# Altium project Simple Oscillator.PrjPcb
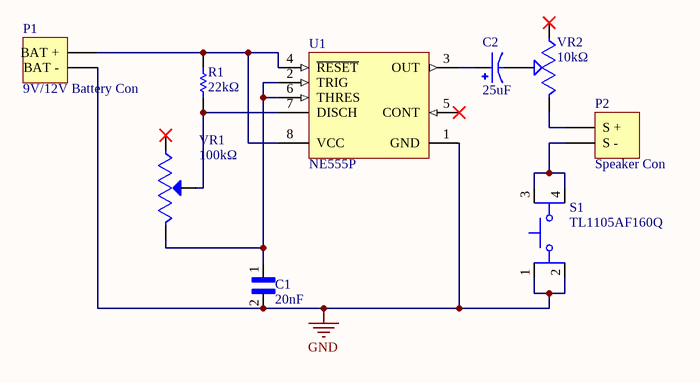
[diagram p0: Simple Oscillator.SchDoc]
1 sheet, 9 parts. Net scope: global (net labels, ports and power ports of the same name join across sheets).
Board file: Simple Oscillator.PcbDoc

## Sheet Simple Oscillator.SchDoc
size A4

### Parts
C1  20nF  [CC0603KRX7R9BB203]
C2  25uF  [EEUED2C250U]
P1  9V/12V Battery Con  [HDR1X2]
P2  Speaker Con  [HDR1X2]
R1  22kΩ  [RESC1005X40X25NL05T10]
S1  TL1105AF160Q  [TL1105AF160Q]
U1  NE555P  [P0008A]
VR1  100kΩ  [3296W-1-104]
VR2  10kΩ  [3296X-1-103]

### Nets
GND: C1.2 P1.1(BAT_-) S1.1 S1.2 U1.1(GND)
NetC1_1: C1.1 U1.2(TRIG) U1.6(THRES) VR1.3(CW)
NetC2_N: C2.N VR2.2(B)
NetC2_P: C2.P U1.3(OUT)
NetP1_2: P1.2(BAT_+) R1.2 U1.4(~{RESET}) U1.8(VCC)
NetP2_1: P2.1(S_+) VR2.3(C)
NetP2_2: P2.2(S_-) S1.3 S1.4
NetR1_1: R1.1 U1.7(DISCH) VR1.2(WIPER)

Not connected (* = marked no-connect by the designer): U1 5(CONT)*; VR1 1(CCW)*; VR2 1(A)*

### Library data of the parts
C1 = CC0603KRX7R9BB203: X7R 20nF 50V 0603 Multilayer Ceramic Capacitors MLCC - SMD/SMT ROHS; Manufacturer: YAGEO; Package: 0603; Packaging: Tape & Reel (TR); Datasheet: https://datasheet.lcsc.com/lcsc/1811082015_YAGEO-CC0603KRX7R9BB203_C282065.pdf; LCSC Part#: C282065; Mfr.Part #: CC0603KRX7R9BB203; Value: 20nF
C2 = EEUED2C250U: Aluminum Electrolytic Capacitors, ED-A Series, 25uF +/- 20%, 160V, Radial lead type(10x16mm); Manufacturer: Panasonic; Package: RADIAL-2 Panasonic; Value: 25uF; Mfr.Part #: EEUED2C250U
P1 P2 = Header 2: Header, 2-Pin; LatestRevisionDate: 17-Jul-2002; LatestRevisionNote: Re-released for DXP Platform.; Publisher: Altium Limited
R1 = CMP-2002-07517-1: 22kΩ 50V Thick Film Resistors 62.5mW ±1% -55℃~+155℃ ±100ppm/℃ 0402 Chip Resistor - Surface Mount ROHS; Manufacturer: YAGEO; Mfr.Part #: RC0402FR-0722KL; Value: 22kΩ; Package: 0402; LCSC Part#: C82868; Packaging: Tape & Reel (TR); Datasheet: https://datasheet.lcsc.com/lcsc/1809181725_YAGEO-RC0402FR-0722KL_C82868.pdf
S1 = TL1105AF160Q: 6mm 1.4mm Round Button 50mA Straight 6mm SPST 12V Plugin,6x6mm Tactile Switches ROHS; Manufacturer: E-Switch; Datasheet: https://datasheet.lcsc.com/lcsc/1809291031_E-Switch-TL1105AF160Q_C273465.pdf; Mfr.Part #: TL1105AF160Q; Package: Plugin,6x6mm; LCSC Part#: C273465
U1 = CMP-2000-04954-1: 4.5V~16V 0℃~+70℃ 10mA DIP-8 Timers / Clock Oscillators ROHS; Manufacturer: Texas Instruments; Datasheet: https://datasheet.lcsc.com/lcsc/1809042012_Texas-Instruments-NE555P_C46749.pdf; Package: DIP-8; Mfr.Part #: NE555P; LCSC Part#: C46749; Packaging: Tube-packed
VR1 = 3296W-1-104: ±10% 100kΩ Plugin Variable Resistors/Potentiometers ROHS; Manufacturer: BOCHEN(Chengdu Guosheng Tech); Package: Plugin; LCSC Part#: C330435; Value: 100kΩ; Mfr.Part #: 3296W-1-104; Packaging: Bag-packed; Datasheet: https://datasheet.lcsc.com/lcsc/1912111437_BOCHEN-Chengdu-Guosheng-Tech-3296W-1-104_C330435.pdf
VR2 = 3296X-1-103: ±10% 10kΩ Plugin Variable Resistors/Potentiometers ROHS; Manufacturer: BOCHEN(Chengdu Guosheng Tech); Value: 10kΩ; Mfr. Part #: 3296X-1-103; Datasheet: https://datasheet.lcsc.com/lcsc/1811011704_BOCHEN-Chengdu-Guosheng-Tech-3296X-1-103_C118955.pdf; Package: Plugin; LCSC Part #: C118955